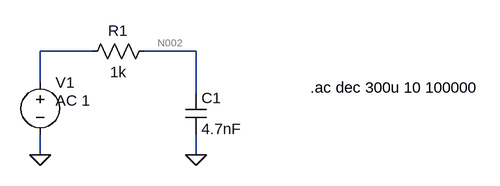
[diagram p0: schematic lpf.asc]
lpf.asc, the LTspice schematic file:
Version 4
SHEET 1 880 680
WIRE 112 96 32 96
WIRE 272 96 192 96
WIRE 32 144 32 96
WIRE 272 160 272 96
WIRE 32 256 32 224
WIRE 272 256 272 224
FLAG 32 256 0
FLAG 272 256 0
SYMBOL res 208 80 R90
WINDOW 0 0 56 VBottom 2
WINDOW 3 32 56 VTop 2
SYMATTR InstName R1
SYMATTR Value 1k
SYMBOL cap 256 160 R0
SYMATTR InstName C1
SYMATTR Value 4.7nF
SYMBOL voltage 32 128 R0
WINDOW 123 24 44 Left 2
WINDOW 39 0 0 Left 0
SYMATTR InstName V1
SYMATTR Value ""
SYMATTR Value2 AC 1
TEXT 448 152 Left 2 !.ac dec 300u 10 100000

The netlist it stands for:
* lpf.asc
R1 N002 N001 1k
C1 N002 0 4.7nF
V1 N001 0 AC 1
.ac dec 300u 10 100000
.backanno
.end

* Results of the author's LTspice run, read from the files saved beside the schematic
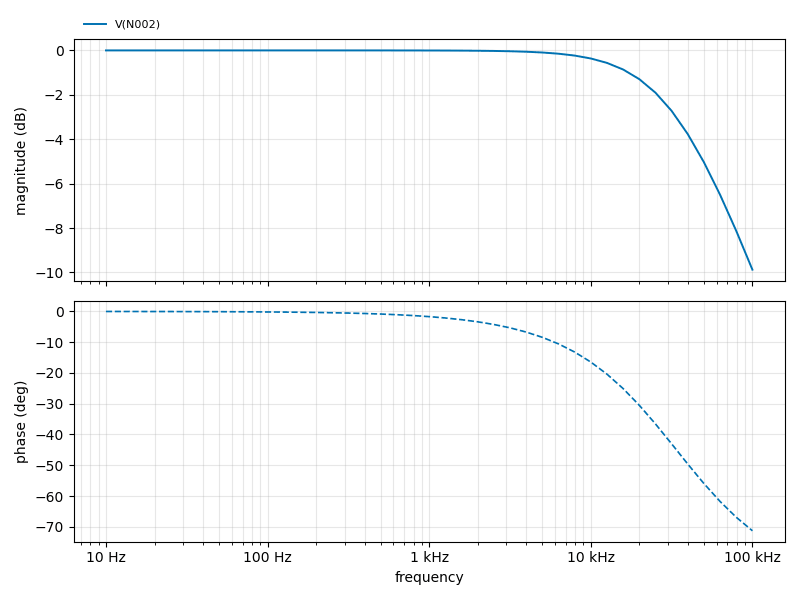
[diagram p1: AC Analysis of lpf.asc, plotted from the saved traces]
* AC Analysis, 1 run:
*   V(N002): -0.00 dB at 10 Hz, -9.88 dB at 100 kHz, peak -0.00 dB at 10 Hz, 3 dB below the peak at 33.68 kHz